# EAGLE design Julia ABL Board V2 (EAGLE 9.6.2)
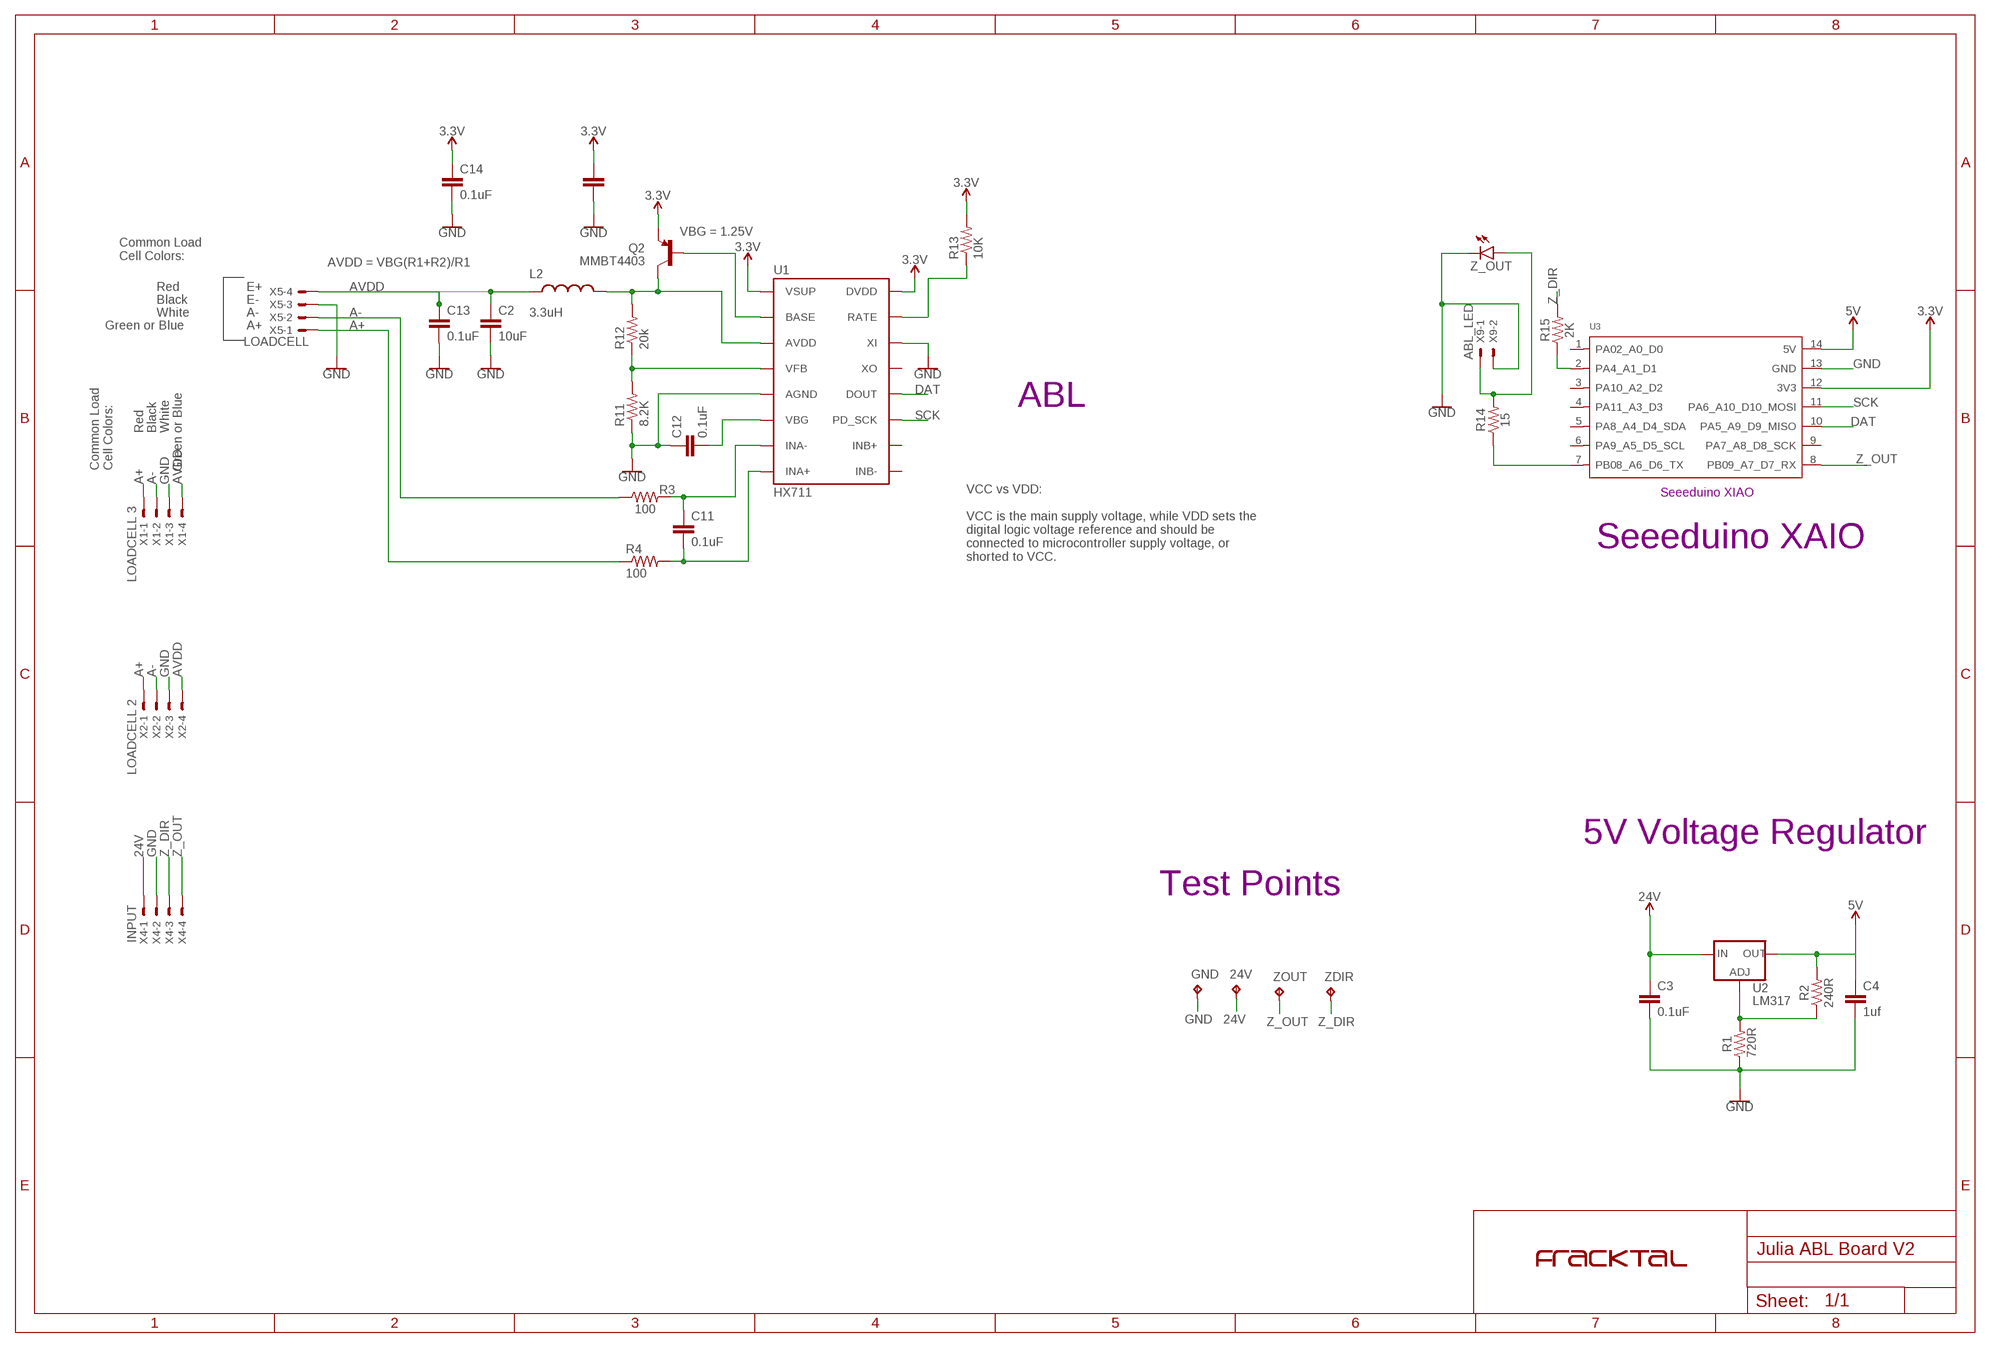
[diagram p0: schematic, sheet 1]

## Parts
24V  TPB2,54  [B2,54]
C1  10uF  10UF50V20%(1210)  [1210]
C2  10uF  10UF50V20%(1210)  [1210]
C3  0.1uF  9.0PF-0603-50V-10%  [0603]
C4  1uf  9.0PF-0603-50V-10%  [0603]
C11  0.1uF  0.1UF-25V-5%(0603)  [0603-CAP]
C12  0.1uF  0.1UF-25V-5%(0603)  [0603-CAP]
C13  0.1uF  0.1UF-25V-5%(0603)  [0603-CAP]
C14  0.1uF  0.1UF-25V-5%(0603)  [0603-CAP]
GND  TPB2,54  [B2,54]
L2  3.3uH  INDUCTOR0805-IND  [0805]
Q2  MMBT4403  TRANSISTOR_PNPMMBT4403  [SOT23-3]
R1  720R  RESISTOR0603  [0603]
R2  240R  RESISTOR0603  [0603]
R3  100  100OHM-1/10W-1%(0603)  [0603-RES]
R4  100  100OHM-1/10W-1%(0603)  [0603-RES]
R11  8.2K  8.2KOHM-1/10W-5%(0603)  [0603-RES]
R12  20k  20KOHM1/10W1%(0603)  [0603-RES]
R13  10K  10KOHM-1/10W-1%(0603)0603  [0603-RES]
R14  15  RESISTOR0603  [0603]
R15  2K  RESISTOR0603  [0603]
U1  HX711  HX711HX711  [SO16]
U2  LM317  V_REG_317SMD  [SOT223]
U3  MOUDLE-SEEEDUINO-XIAO  [MOUDLE14P-2.54-21X17.8MM]
U$2  FRACKTALLOGO  [FRACKTALLOGO]
X1  LOADCELL 3  JST-XH-04-PIN-LONG-PAD  [JST-XH-04-PACKAGE-LONG-PAD]
X2  LOADCELL 2  JST-XH-04-PIN-LONG-PAD  [JST-XH-04-PACKAGE-LONG-PAD]
X4  INPUT  JST-XH-04-PIN-LONG-PAD  [JST-XH-04-PACKAGE-LONG-PAD]
X5  LOADCELL  JST-XH-04-PIN-LONG-PAD  [JST-XH-04-PACKAGE-LONG-PAD]
X9  ABL_LED  JST-XH-02-PIN-LONG-PAD  [JST-XH-02-PACKAGE-LONG-PAD]
Z_OUT  LEDSML0603  [SML0603]
ZDIR  TPB2,54  [B2,54]
ZOUT  TPB2,54  [B2,54]

## Nets
3.3V: C1.1 C14.1 Q2.2(E) R13.2 U1.1(VSUP) U1.16(DVDD) U3.12(3V3)
5V: C4.1 R2.2 U2.2(OUT) U3.14(5V)
24V: 24V.TP C3.1 U2.3(IN) X4.1
A+: R4.1 X1.1 X2.1 X5.1
A-: R3.1 X1.2 X2.2 X5.2
ADJ: R1.2 R2.1 U2.1(ADJ)
AVDD: C2.1 C13.1 L2.1 X1.4 X2.4 X5.4
DAT: U1.12(DOUT) U3.10(PA5_A9_D9_MISO)
GND: C1.2 C2.2 C3.2 C4.2 C12.1 C13.2 C14.2 GND.TP R1.1 R11.1 U1.5(AGND) U1.14(XI) U3.13(GND) X1.3 X2.3 X4.2 X5.3 X9.2 Z_OUT.C
N$9: Q2.1(B) U1.2(BASE)
N$10: R11.2 R12.1 U1.4(VFB)
N$11: C12.2 U1.6(VBG)
N$12: L2.2 Q2.3(C) R12.2 U1.3(AVDD)
N$13: R13.1 U1.15(RATE)
N$15: C11.1 R3.2 U1.7(INA-)
N$16: C11.2 R4.2 U1.8(INA+)
N$17: R14.2 X9.1 Z_OUT.A
N$18: R14.1 U3.7(PB08_A6_D6_TX)
N$19: R15.1 U3.2(PA4_A1_D1)
SCK: U1.11(PD_SCK) U3.11(PA6_A10_D10_MOSI)
Z_DIR: R15.2 X4.3 ZDIR.TP
Z_OUT: U3.8(PB09_A7_D7_RX) X4.4 ZOUT.TP
Unconnected: U1.9(INB-) U1.10(INB+) U1.13(XO) U3.1(PA02_A0_D0) U3.3(PA10_A2_D2) U3.4(PA11_A3_D3) U3.5(PA8_A4_D4_SDA) U3.6(PA9_A5_D5_SCL) U3.9(PA7_A8_D8_SCK)

## Notes on the sheet
- VBG = 1.25V
- Common Load
  Cell Colors:
- AVDD = VBG(R1+R2)/R1
- Red | E+
- Black | E-
- White | A-
- Green or Blue | A+
- ABL
- Red | Black | White
- Common Load
  Cell Colors:
- Green or Blue
- Seeeduino XIAO
- Seeeduino XAIO
- VCC vs VDD:
  
  VCC is the main supply voltage, while VDD sets the
  digital logic voltage reference and should be
  connected to microcontroller supply voltage, or
  shorted to VCC.
- 5V Voltage Regulator
- Test Points

## Library data of the parts
24V GND ZDIR ZOUT = testpad:TP: Test pad
C1 C2 = SparkFun-Capacitors:10UF50V20%(1210): CAP-09824; PROD_ID: CAP-09824
C3 C4 = SparkFun-Capacitors:9.0PF: 9.0pF ceramic capacitors A capacitor is a passive two-terminal electrical component used to store electrical energy temporarily in an electric field.; PROD_ID: CAP-09341; VALUE: 9.0pF
C11-C14 = SparkFun-Capacitors:0.1UF-25V-5%(0603): CAP-08604; PROD_ID: CAP-08604
L2 = SparkFun-Passives:INDUCTOR: Inductors Basic Inductor/Choke - 0603 and 1206. Footprints are not proven and vary greatly between part numbers. INDUCTOR POWER 3.3UH 4.0A SMD 0.197" L x 0.197" W x 0.177" H (5.00mm x 5.00mm x 4.50mm); PROD_ID: NDUC-13076
Q2 = SparkFun-DiscreteSemi:TRANSISTOR_PNP: Generic PNP BJT Double check pinouts against datasheets- not all devices are the same! MMBT3906 - 40V 200mA SOT-23 (TRANS-08052) MMBT4403 - 40V 600mA SOT-23 (TRANS-09245); PROD_ID: TRANS-09245
R1 R2 R14 R15 = SparkFun-Resistors:RESISTOR: Generic Resistor Package
R3 R4 = SparkFun-Resistors:100OHM-1/10W-1%(0603): RES-07863; PROD_ID: RES-07863
R11 = SparkFun-Resistors:8.2KOHM-1/10W-5%(0603): RES-10646; PROD_ID: RES-10646
R12 = SparkFun-Resistors:20KOHM1/10W1%(0603): RES-09383; PROD_ID: RES-09383
R13 = SparkFun-Resistors:10KOHM-1/10W-1%(0603): RES-00824; PROD_ID: RES-00824
U1 = Testing:HX711; PROD_ID: IC-12445
U2 = SparkFun-IC-Power:V_REG_317: Voltage Regulator Standard LM317 adjustable voltage regulator. AOI (Adjust Output Input). Google 'LM317 Calculator' for easy to use app to get the two resistor values needed. 240/720 for 5V output. 240/390 for 3.3V output. Spark Fun Electronics SKU : COM-00527
U3 = Seeeduino XIAO:MOUDLE-SEEEDUINO-XIAO
U$2 = FracktalWorks_Eagle_Library:FRACKTALLOGO
X1 X2 X4 X5 = Rembrandt Electronics - JST XH Connectors v1-0:JST-XH-04-PIN: JST XH Connector 2 Pin Wire to board connector. Pitch: 2,54 mm, (0.100") Number of pins: 4 Created by Rembrandt Electronics www.rembrandtelectronics.com
X9 = Rembrandt Electronics - JST XH Connectors v1-0:JST-XH-02-PIN: JST XH Connector 2 Pin Wire to board connector. Pitch: 2,54 mm, (0.100") Number of pins: 2 Created by Rembrandt Electronics www.rembrandtelectronics.com
Z_OUT = led:LED: LED OSRAM: - CHIPLED LG R971, LG N971, LY N971, LG Q971, LY Q971, LO R971, LY R971 LH N974, LH R974 LS Q976, LO Q976, LY Q976 LO Q996 - Hyper CHIPLED LW Q18S LB Q993, LB Q99A, LB R99A - SideLED LS A670, LO A670, LY A670, LG A670, LP A670 LB A673, LV A673, LT A673, LW A673 LH A674 LY A675 LS A676, LA A676, LO A676, LY A676, LW A676 LS A679, LY A679, LG A679 - Hyper Micro SIDELED® LS Y876, LA Y876, LO Y876, LY Y876 LT Y87S - SmartLED LW L88C, LW L88S LB L89C, LB L89S, LG L890 LS L89K, LO L89K, LY L89K LS L896, LA L896, LO L896, LY L896 - TOPLED LS T670, LO T670, LY T670, LG T670, LP T670 LSG T670, LSP T670, LSY T670, LOP T670, LYG T670 LG T671, LOG T671, LSG T671 LB T673, LV T673, LT T673, LW T673 LH T674 LS T676, LA T676, LO T676, LY T676, LB T676, LH T676, LSB T676, LW T676 LB T67C, LV T67C, LT T67C, LS T67K, LO T67K, LY T67K, LW E67C LS E67B, LA E67B, LO E67B, LY E67B, LB E67C, LV E67C, LT E67C LW T67C LS T679, LY T679, LG T679 LS T770, LO T770, LY T770, LG T770, LP T770 LB T773, LV T773, LT T773, LW T773 LH T774 LS E675, LA E675, LY E675, LS T675 LS T776, LA T776, LO T776, LY T776, LB T776 LHGB T686 LT T68C, LB T68C - Hyper Mini TOPLED® LB M676 - Mini TOPLED Santana® LG M470 LS M47K, LO M47K, LY M47K Source: http://www.osram.convergy.de LUXEON: - LUMILED® LXK2-PW12-R00, LXK2-PW12-S00, LXK2-PW14-U00, LXK2-PW14-V00 LXK2-PM12-R00, LXK2-PM12-S00, LXK2-PM14-U00 LXK2-PE12-Q00, LXK2-PE12-R00, LXK2-PE12-S00, LXK2-PE14-T00, LXK2-PE14-U00 LXK2-PB12-K00, LXK2-PB12-L00, LXK2-PB12-M00, LXK2-PB14-N00, LXK2-PB14-P00, LXK2-PB14-Q00 LXK2-PR12-L00, LXK2-PR12-M00, LXK2-PR14-Q00, LXK2-PR14-R00 LXK2-PD12-Q00, LXK2-PD12-R00, LXK2-PD12-S00 LXK2-PH12-R00, LXK2-PH12-S00 LXK2-PL12-P00, LXK2-PL12-Q00, LXK2-PL12-R00 Source: www.luxeon.com KINGBRIGHT: KA-3528ASYC Source: www.kingbright.com

## Board
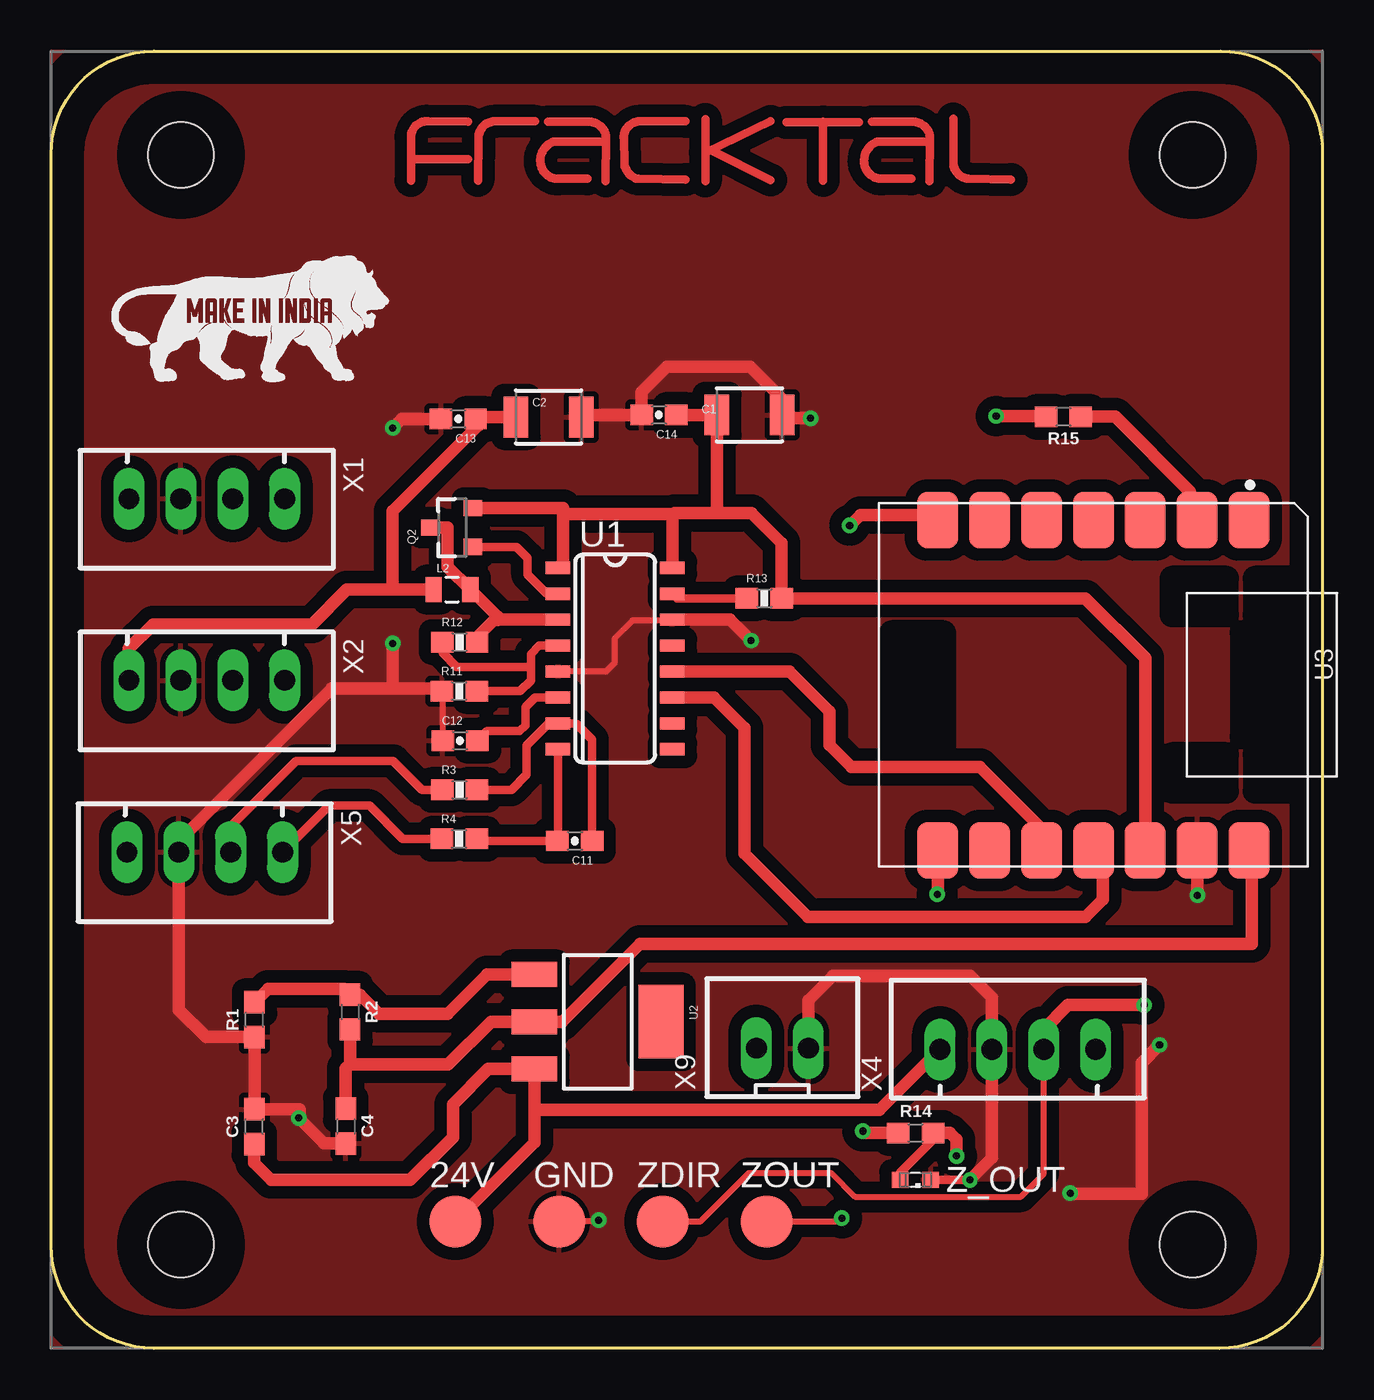
[diagram p1: board, top side]
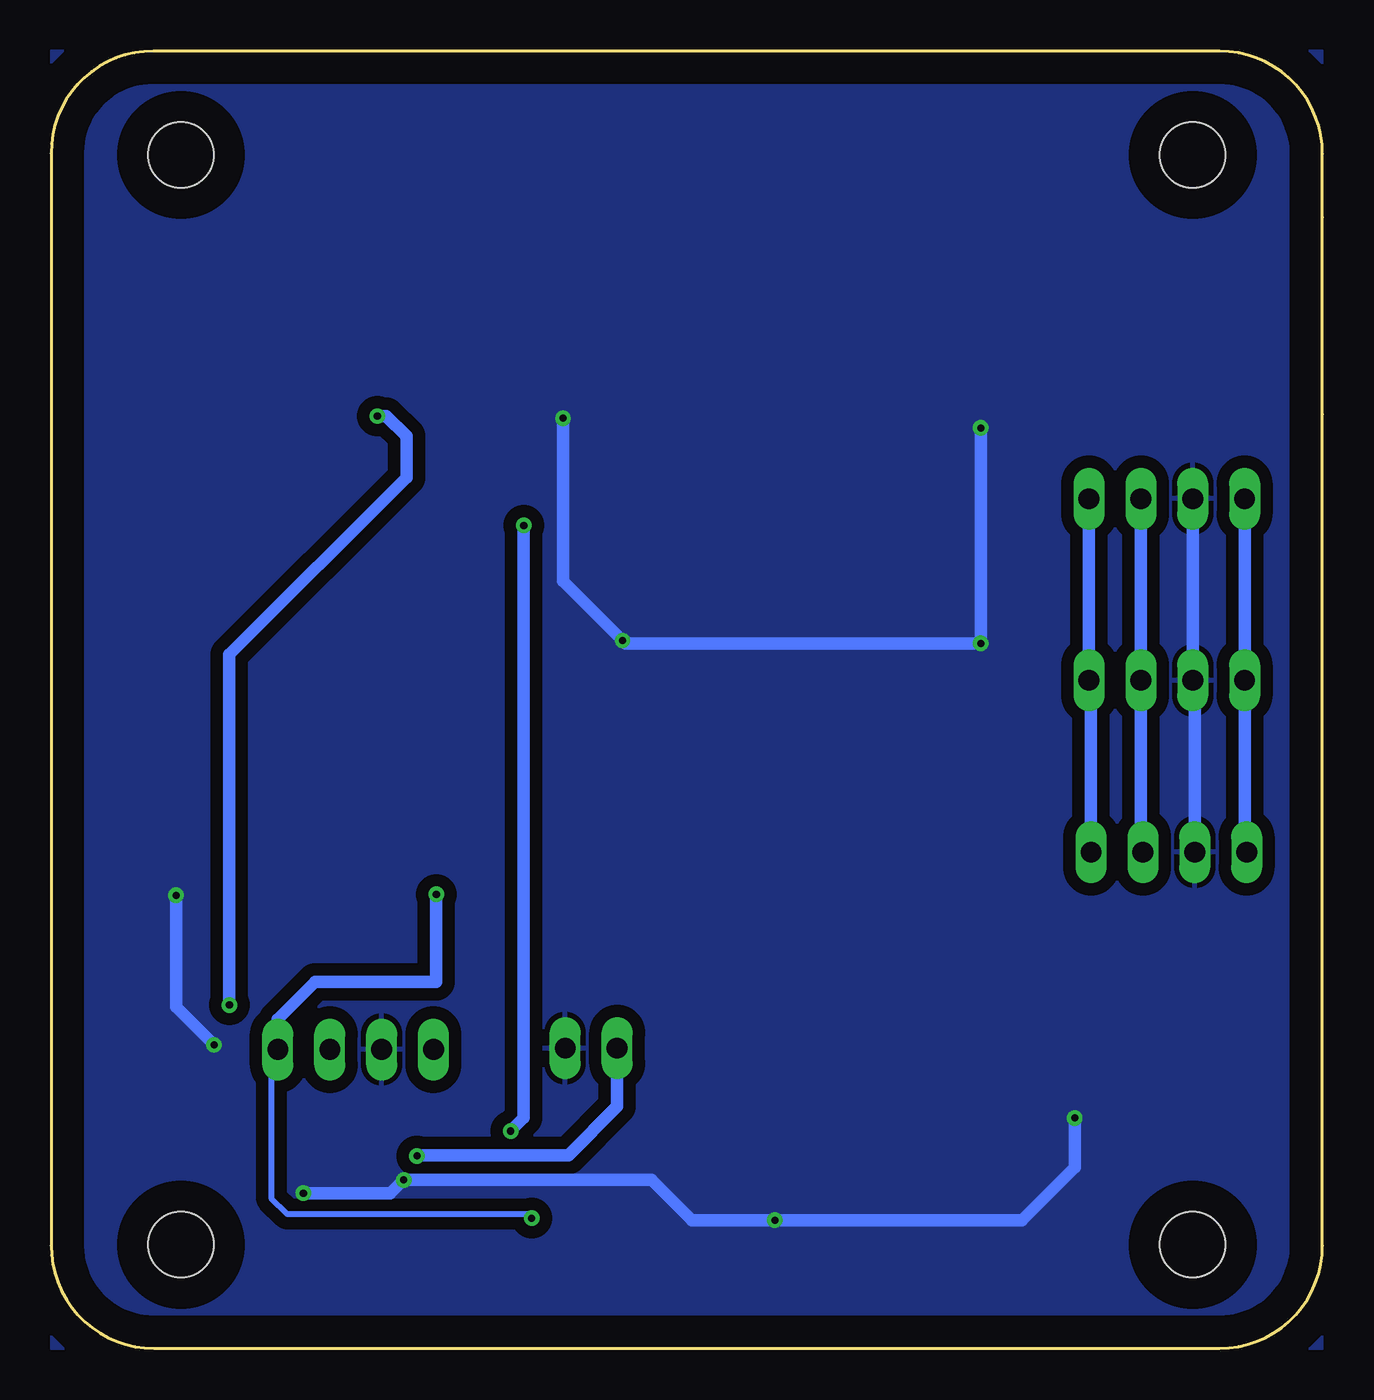
[diagram p2: board, bottom side, seen from below]

Size 62.23 x 63.5 mm. Coordinates in mm from the lower left corner, seen from the top.
Outline: 0,45.73 0,55.36
Outline: 5.04,0 arc-90 0,5.04 0,58.46 arc-90 5.04,63.5 57.23,63.5 arc-90 62.23,58.5 62.23,5.04 arc-90 57.19,0 5.04,0
Copper layers (1*16): Top 0.035mm / dielectric 1.5mm / Bottom 0.035mm
Design rules "LionCircuits": minimum track width 8mil, minimum drill 0.35mm, track to track 8mil, track to pad 8mil, pad to pad 8mil, via to via 8mil, smd to smd 8mil, copper to edge 60mil, drill to drill 10mil, minimum pad ring 10mil, minimum via ring 8mil, stop-mask expansion 4mil, vias tented up to drill 0mil, thermal gap 10mil
Holes 3.2 mm at 55.88,58.42 55.88,5.08 6.35,5.08 6.35,58.42

### Footprints (pad centres in the part's own frame; a part is rotated, then mirrored left to right if it is on the bottom)
B2,54 = smd 2.54 x 2.54: TP 0,0
1210 = smd 1.2 x 2: 1 -1.6,0; 2 1.6,0
0603 = smd 1.1 x 1: 1 -0.85,0; 2 0.85,0
0603-CAP = smd 1.1 x 1: 1 -0.85,0; 2 0.85,0
0805 = smd 0.8 x 1.2: 1 -0.9,0; 2 0.9,0
SOT23-3 = smd 0.8 x 0.9: 1 -0.95,-1; 2 0.95,-1; 3 0,1.1
0603-RES = smd 1.1 x 1: 1 -0.85,0; 2 0.85,0
SO16 = smd 0.6 x 1.2: 1 -4.445,-2.8; 2 -3.175,-2.8; 3 -1.905,-2.8; 4 -0.635,-2.8; 5 0.635,-2.8; 6 1.905,-2.8; 7 3.175,-2.8; 8 4.445,-2.8; 9 4.445,2.8; 10 3.175,2.8; 11 1.905,2.8; 12 0.635,2.8; 13 -0.635,2.8; 14 -1.905,2.8; 15 -3.175,2.8; 16 -4.445,2.8
SOT223 = smd 1.219 x 2.235: 1 -2.311,-3.099; 2 0,-3.099; 3 2.311,-3.099 | smd 3.6 x 2.2: 4 0,3.099
MOUDLE14P-2.54-21X17.8MM = smd 2.75 x 2: 1 0.835,18.12; 2 0.835,15.58; 3 0.835,13.04; 4 0.835,10.5; 5 0.835,7.96; 6 0.835,5.42; 7 0.835,2.88; 8 17,2.88; 9 17,5.42; 10 17,7.96; 11 17,10.5; 12 17,13.04; 13 17,15.58; 14 17,18.12
JST-XH-04-PACKAGE-LONG-PAD = drill 1.016 long: 1 -3.81,0; 2 -1.27,0; 3 1.27,0; 4 3.81,0
JST-XH-02-PACKAGE-LONG-PAD = drill 1.016 long: 1 -1.27,0; 2 1.27,0
SML0603 = smd 0.8 x 0.8: A 0.75,0; C -0.75,0

### Placement (x,y rotation side)
24V  19.79,6.22 0 top
C1  34.18,45.69 0 top
C2  24.35,45.59 0 top
C3  9.95,10.86 90 top
C4  14.43,10.88 270 top
C11  25.64,24.84 180 top
C12  20.02,29.75 0 top
C13  19.93,45.49 180 top
C14  29.76,45.69 180 top
GND  24.87,6.22 0 top
L2  19.62,37.14 0 top
Q2  19.65,40.18 90 top
R1  9.96,16.09 90 top
R2  14.63,16.47 270 top
R3  20,27.34 0 top
R4  19.98,24.94 0 top
R11  19.98,32.17 0 top
R12  20,34.57 0 top
R13  34.91,36.72 0 top
R14  42.31,10.55 0 top
R15  49.55,45.6 180 top
U1  27.61,33.77 270 top
U2  26.75,15.99 270 top
U3  40.52,41.38 270 top
U$1  [MAKEININDIA]  3.94,46.61 0 top
U$2  29.61,57.06 0 top
X1  7.62,41.59 180 top
X2  7.62,32.7 180 top
X4  47.32,14.63 0 top
X5  7.52,24.29 180 top
X9  35.8,14.69 0 top
Z_OUT  42.3,8.25 180 top
ZDIR  29.95,6.22 0 top
ZOUT  35.03,6.22 0 top

### Tracks (layer width: path | path; a pad name or v marks a point on that pad's centre or on a via)
3.3V
  Top 0.61: C14.1 C1.1 32.58,40.89 | Q2.2 25.07,41.13 25.07,40.84 | 25.07,40.84 30.34,40.84 30.41,40.78 | 30.41,40.78 U1.16 | 25.07,40.84 25.07,38.47 U1.1 | U3.12 53.56,33.79 50.64,36.71 R13.2 35.76,39.42 34.28,40.89 32.58,40.89 | 32.58,40.89 30.52,40.89 30.41,40.78
5V
  Top 0.61: R2.2 14.63,13.9 | 14.63,13.9 19.44,13.9 21.53,15.99 U2.2 25.01,15.99 28.83,19.81 58.77,19.81 58.77,24.25 U3.14 | C4.1 14.43,13.7 14.63,13.9
24V
  Top 0.61: C3.1 9.95,9.07 10.77,8.25 17.58,8.25 19.67,10.34 19.67,11.95 21.4,13.68 U2.3 | U2.3 23.66,10.08 24V.TP | U2.3 23.66,11.67 40.54,11.67 X4.1
A+
  Top 0.406: R4.1 17.22,24.94 15.59,26.57 13.61,26.57 X5.1
  Bottom 0.61: X5.1 11.33,32.6 X2.1 X1.1
A-
  Top 0.406: R3.1 18.17,27.34 16.75,28.76 12,28.76 8.79,25.55 X5.2
  Bottom 0.61: X1.2 X2.2 8.89,24.39 X5.2
ADJ
  Top 0.61: U2.1 21.35,18.3 19.41,16.37 16.06,16.37 15.12,17.32 R2.1 14.34,17.6 10.62,17.6 R1.2
AVDD
  Top 0.61: C2.1 20.88,45.59 | 20.88,45.59 C13.1 | L2.1 16.71,37.14 | 16.71,37.14 14.47,37.14 12.77,35.44 4.99,35.44 3.81,34.26 X2.4 | 16.71,37.14 16.71,40.98 20.88,45.14 20.88,45.59
  Bottom 0.61: X1.4 X2.4 3.81,24.39 X5.4
DAT
  Top 0.61: U3.10 48.48,25.44 45.45,28.47 39.17,28.47 38.1,29.54 38.1,31.17 36.14,33.13 U1.12
GND  (via drill 0.35)
  Top 0.305: 12.16,11.24 v12.12,11.28 | v26.8,6.28 26.74,6.22 GND.TP | U1.14 30.36,35.63 28.45,35.63 27.58,34.76 27.58,33.55 27.16,33.13 U1.5 | R11.1 19.17,32.13 C12.1
  Top 0.406: v44.97,8.25 Z_OUT.C
  Top 0.61: C2.2 26.06,45.69 C14.2 28.91,46.81 30.15,48.06 34.21,48.06 35.95,46.32 35.95,45.53 | 16.71,32.3 13.73,32.3 6.25,24.82 X5.3 6.25,16.58 7.59,15.24 R1.1 C3.2 12.16,11.71 12.16,11.24 13.37,10.03 C4.2 | 16.71,32.3 18.99,32.3 R11.1 | U3.13 56.1,22.19 v56.11,22.17 | v54.26,14.86 53.38,13.98 53.38,7.57 49.91,7.57 v49.88,7.6 | v44.97,8.25 46.05,9.32 X4.2 46.05,17.18 45,18.23 38.26,18.23 37.06,17.04 X9.2 | U1.14 33.24,35.67 v34.26,34.65 | v37.17,45.53 35.95,45.53 | 35.95,45.53 C1.2 | 16.71,32.3 v16.71,34.5 v16.72,34.51 | v16.72,45.05 17.16,45.49 C13.2
  Bottom 0.61: X5.3 6.25,32.6 X2.3 X1.3 | v56.11,22.17 56.11,16.71 v54.26,14.86 | v49.88,7.6 49.87,7.58 45.64,7.58 v44.97,8.25 32.84,8.25 30.87,6.28 v26.8,6.28 14.72,6.28 12.12,8.87 v12.12,11.28 | v37.17,45.53 37.17,37.56 v34.26,34.65 34.12,34.51 v16.72,34.51 v16.72,45.05
  pour Top (isolate 0.61): 0,63.51 62.23,63.51 62.23,0 0,0
  pour Bottom (isolate 0.61): 0,63.5 62.23,63.5 62.23,0 0,0
N$9
  Top 0.406: U1.2 24.26,36.94 23.32,37.87 23.32,38.69 22.78,39.23 Q2.1
N$10
  Top 0.406: R11.2 22.96,32.17 23.48,32.69 23.48,33.36 | 23.48,33.36 23.48,34 23.88,34.4 U1.4 | 23.48,33.36 19.86,33.36 19.15,34.06 R12.1
N$11
  Top 0.406: C12.2 21.33,30.21 22.93,30.21 23.22,30.5 23.22,31.39 23.69,31.86 U1.6
N$12
  Top 0.61: 21.85,35.82 L2.2 19.41,38.26 19.41,40.18 Q2.3 | 21.85,35.82 20.85,34.82 R12.2 | 21.85,35.82 21.85,35.66 21.86,35.67 U1.3
N$13
  Top 0.406: R13.1 30.63,36.71 U1.15
N$15
  Top 0.406: C11.1 26.49,29.79 25.69,30.59 U1.7 24.35,30.59 23.27,29.52 23.27,28.09 22.53,27.34 R3.2
N$16
  Top 0.406: U1.8 24.81,24.86 C11.2 20.93,24.84 R4.2
N$17  (via drill 0.35)
  Top 0.406: R14.2 43.16,10.21 41.55,8.6 Z_OUT.A
  Top 0.61: v44.32,9.42 44.32,10.22 43.99,10.55 R14.2
  Bottom 0.61: X9.1 34.53,11.84 36.91,9.46 44.28,9.46 v44.32,9.42
N$18  (via drill 0.35)
  Top 0.61: v39.73,10.64 39.83,10.55 R14.1 | v39.09,40.28 39.61,40.8 43.14,40.8 U3.7
  Bottom 0.61: v39.09,40.28 39.09,11.28 v39.73,10.64
N$19
  Top 0.61: R15.1 52.09,45.6 55.74,41.95 55.74,39.83 56.1,40.19 U3.2
SCK
  Top 0.61: U3.11 51.47,23.92 51.47,21.97 50.63,21.13 37.04,21.13 33.95,24.22 33.95,30.36 32.45,31.86 U1.11
Z_DIR  (via drill 0.35)
  Top 0.305: ZDIR.TP 31.78,6.22 34.15,8.59 38.19,8.59 39.35,7.43 47.47,7.43 48.59,8.55 X4.3
  Top 0.61: v53.5,16.81 49.78,16.81 48.59,15.62 X4.3 | v46.26,45.63 48.67,45.63 R15.2
  Bottom 0.61: v53.5,16.81 53.5,33.97 44.84,42.63 44.84,44.65 45.82,45.63 v46.26,45.63
Z_OUT  (via drill 0.35)
  Top 0.305: ZOUT.TP 38.55,6.22 v38.71,6.38
  Top 0.61: U3.8 43.4,22.22 v43.38,22.22
  Bottom 0.305: v38.71,6.38 38.91,6.58 50.67,6.58 51.45,7.36 51.45,14.31 X4.4
  Bottom 0.61: v43.38,22.22 43.38,17.94 49.3,17.94 51.13,16.11 X4.4

### Text on the board
tValues: Julia ABL Board V2
Reference: Design by @vjvarada